# Altium schematic sheet BuckCircuit.SchDoc
size A4; SheetNumber: 1; SheetTotal: 2
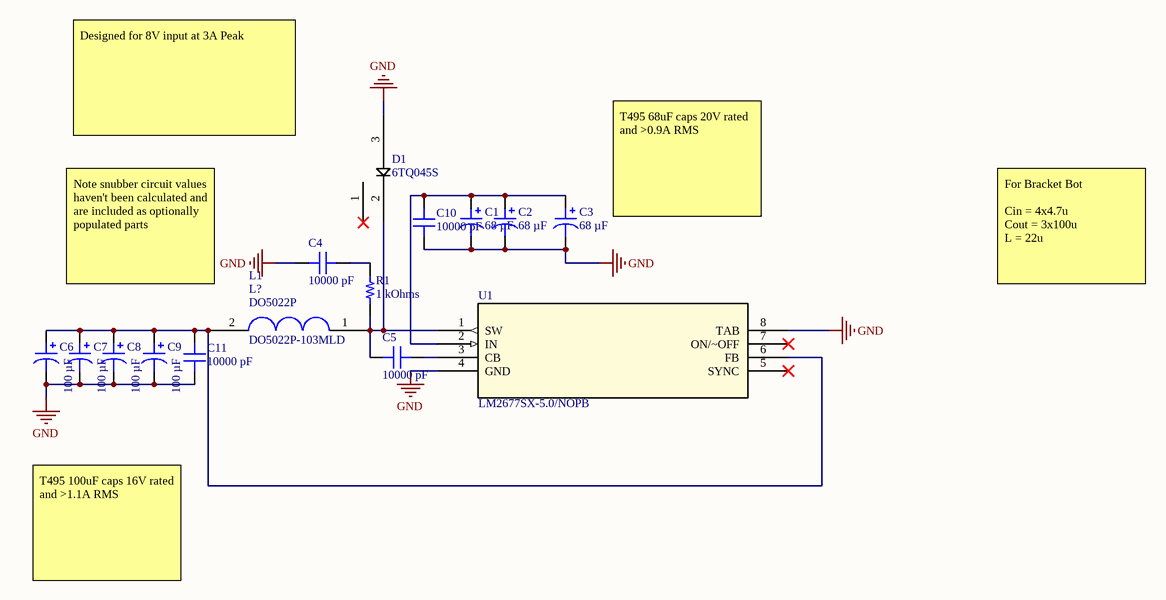
[diagram p0: BuckCircuit.SchDoc]

## Parts
C1  68 µF  [CAP POL 2917_7343]
C2  68 µF  [CAP POL 2917_7343]
C3  68 µF  [CAP POL 2917_7343]
C4  10000 pF  [CAP 0805_2012]
C5  10000 pF  [CAP 0805_2012]
C6  100 µF  [CAP POL 2917_7343]
C7  100 µF  [CAP POL 2917_7343]
C8  100 µF  [CAP POL 2917_7343]
C9  100 µF  [CAP POL 2917_7343]
C10  10000 pF  [CAP 0805_2012]
C11  10000 pF  [CAP 0805_2012]
D1  6TQ045S  [DPAK 6TQ045S]
L1  DO5022P-103MLD  [DO5022P-103MLD]
R1  1 kOhms  [RES 0603_1608]
U1  LM2677SX-5.0/NOPB  [TS7B]

## Nets
GND: C1.2 C2.2 C3.2 C4.2 C6.2 C7.2 C8.2 C9.2 C10.1 C11.1 D1.3 U1.4(GND) U1.8(TAB)
NetC1_1: C1.1 C2.1 C3.1 C10.2 U1.2(IN)
NetC4_1: C4.1 R1.2
NetC5_1: C5.1 D1.2 L1.1 R1.1 U1.1(SW)
NetC5_2: C5.2 U1.3(CB)
NetC6_1: C6.1 C7.1 C8.1 C9.1 C11.2 L1.2 U1.6(FB)

Not connected (* = marked no-connect by the designer): D1 1*; U1 5(SYNC)* 7(ON/~OFF)*

## Notes on the sheet
- Designed for 8V input at 3A Peak
- (near C3) T495 68uF caps 20V rated and >0.9A RMS
- Note snubber circuit values haven't been calculated and are included as optionally populated parts
- For Bracket Bot
  Cin = 4x4.7u
  Cout = 3x100u
  L = 22u
- T495 100uF caps 16V rated and >1.1A RMS
- (in symbol DO5022P-103MLD) L?; DO5022P

## Library data of the parts
C1-C3 = T495D686K020ATE150: CAP TANT 68UF 10% 20V 2917; manufacturer: KEMET; Manufacturer Size Code: D; ESR (Equivalent Series Resistance): 150mOhm; Lifetime @ Temp.: 2000 Hrs @ 85°C; Type: Molded; Part Number: T495D686K020ATE150; Value: 68 µF; Capacitance: 68 µF; componentlink1description: Datasheet; componentlink1url: https://api.kemet.com/component-edge/download/datasheet/T495D686K020ATE150.pdf; componentlink2description: DigiKey Link; componentlink2url: https://www.digikey.com/en/products/detail/kemet/T495D686K020ATE150/818751; Device Package: 2917 (7343 Metric); Features: General Purpose; Height - Seated (Max): 0.122" (3.10mm); lastupdated: 2022-07-10 9:38:15 AM; Lifecycle Status: Active; Minimum Order: 1; Mounting Type: Surface Mount; Operating Temperature: -55°C ~ 125°C; Package / Case: 2917 (7343 Metric); packaging: TapeAndReel; partid: 3098; Part Status: Active; price: 0.71; series: T495; Size / Dimension: 0.287" L x 0.169" W (7.30mm x 4.30mm); Supplier 1: DigiKey; Supplier Part Number 1: 399-3890-1-ND; Tolerance: ±10%; Voltage - Rated: 20 V
C4 C5 C10 C11 = C0805X103J5RACAUTO: CAP CER 10000PF 50V X7R 0805; manufacturer: KEMET; Tolerance: ±5%; Part Number: C0805X103J5RACAUTO; Value: 10000 pF; Applications: Automotive, Boardflex Sensitive; Capacitance: 10000 pF; componentlink1description: Datasheet; componentlink1url: https://api.kemet.com/component-edge/download/datasheet/C0805X103J5RACAUTO.pdf; componentlink2description: DigiKey Link; componentlink2url: https://www.digikey.com/en/products/detail/kemet/C0805X103J5RACAUTO/6097192; Device Package: 0805 (2012 Metric); Features: Soft Termination; lastupdated: 2022-06-30 10:06:02 PM; Lifecycle Status: Active; Minimum Order: 1; Mounting Type: Surface Mount, MLCC; Operating Temperature: -55°C ~ 125°C; Package / Case: 0805 (2012 Metric); packaging: TapeAndReel; partid: 32207; Part Status: Active; price: 0.10; Ratings: AEC-Q200; series: SMD Auto X7R Flex; Size / Dimension: 0.079" L x 0.049" W (2.00mm x 1.25mm); Supplier 1: DigiKey; Supplier Part Number 1: 399-C0805X103J5RACAUTOCT-ND; Temperature Coefficient: X7R; Thickness (Max): 0.039" (0.98mm); Voltage - Rated: 50V
C6-C9 = T495D107M016ATE100: CAP TANT 100UF 20% 16V 2917; manufacturer: KEMET; Manufacturer Size Code: D; ESR (Equivalent Series Resistance): 100mOhm; Lifetime @ Temp.: 2000 Hrs @ 85°C; Type: Molded; Part Number: T495D107M016ATE100; Value: 100 µF; Capacitance: 100 µF; componentlink1description: Datasheet; componentlink1url: https://api.kemet.com/component-edge/download/datasheet/T495D107M016ATE100.pdf; componentlink2description: DigiKey Link; componentlink2url: https://www.digikey.com/en/products/detail/kemet/T495D107M016ATE100/1833498; Device Package: 2917 (7343 Metric); Features: General Purpose; Height - Seated (Max): 0.122" (3.10mm); lastupdated: 2022-07-10 9:38:16 AM; Lifecycle Status: Active; Minimum Order: 1; Mounting Type: Surface Mount; Operating Temperature: -55°C ~ 125°C; Package / Case: 2917 (7343 Metric); packaging: TapeAndReel; partid: 2988; Part Status: Active; price: 0.77; series: T495; Size / Dimension: 0.287" L x 0.169" W (7.30mm x 4.30mm); Supplier 1: DigiKey; Supplier Part Number 1: 399-5262-1-ND; Tolerance: ±20%; Voltage - Rated: 16 V
R1 = CPF0603B1K0E: RES SMD 1K OHM 0.1% 1/16W 0603; Manufacturer: TE Connectivity Passive Product; Power (Watts): 0.063W, 1/16W; Temperature Coefficient: ±25ppm/°C; Part Number: CPF0603B1K0E; Value: 1 kOhms; ComponentLink1Description: Datasheet; ComponentLink1URL: https://www.te.com/commerce/DocumentDelivery/DDEController?Action=srchrtrv&DocNm=1773200&DocType=DS&DocLang=English; ComponentLink2Description: DigiKey Link; ComponentLink2URL: https://www.digikey.com/en/products/detail/te-connectivity-passive-product/CPF0603B1K0E/2390473; Composition: Thin Film; Device Package: 0603 (1608 Metric); Height - Seated (Max): 0.022" (0.55mm); LastUpdated: 2022-08-09 12:17:58 PM; Lifecycle Status: Active; Minimum Order: 1; Number of Terminations: 2; Operating Temperature: -55°C ~ 155°C; Package / Case: 0603 (1608 Metric); Packaging: TapeAndReel; PartId: 4877; Part Status: Active; Price: 0.10; Resistance: 1 kOhms; Series: CPF, Neohm; Size / Dimension: 0.061" L x 0.031" W (1.55mm x 0.80mm); Supplier 1: DigiKey; Supplier Part Number 1: A119887CT-ND; Supplier Device Package: 0603; Tolerance: ±0.1%
U1 = LM2677SX-5.0/NOPB: No Description Available; Mfr_Name: Texas Instruments; Type: DEV; Copyright: Copyright (C) 2022 Ultra Librarian. All rights reserved.; Manufacturer_Part_Number: LM2677SX-5.0/NOPB; Digi-Key_Part_Number_1: 2156-LM2677SX-5.0/NOPB-ND; Digi-Key_Part_Number_2: 296-48568-1-ND; Digi-Key_Part_Number_3: 296-48568-2-ND; Digi-Key_Part_Number_4: 296-48568-6-ND; Digi-Key_Part_Number_5: LM2677SX-5.0/NOPB-ND; RefDes: RefDes